# EAGLE board EEZ CF-DIC r5B7 (EAGLE 7.2.0), part 1 of 2
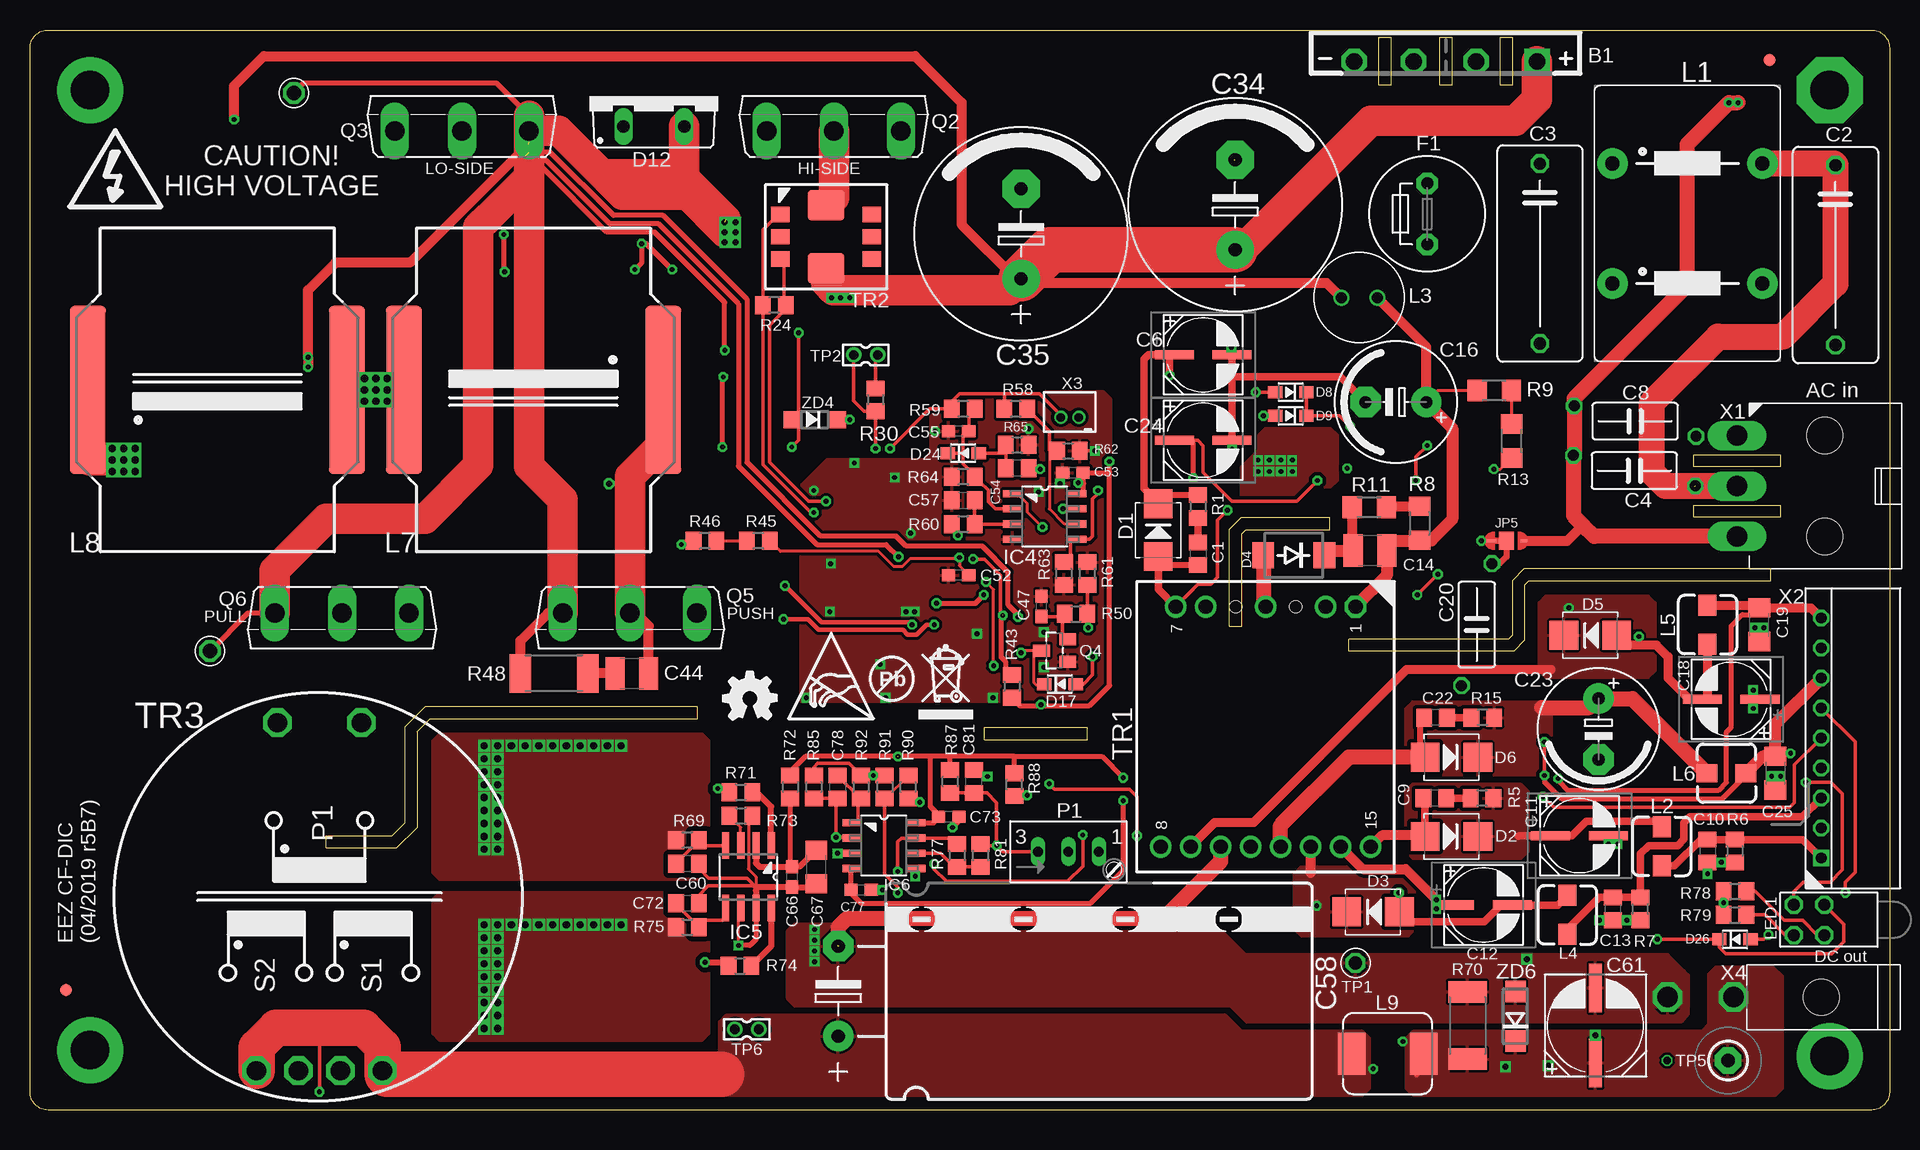
[diagram p3: board, top side]
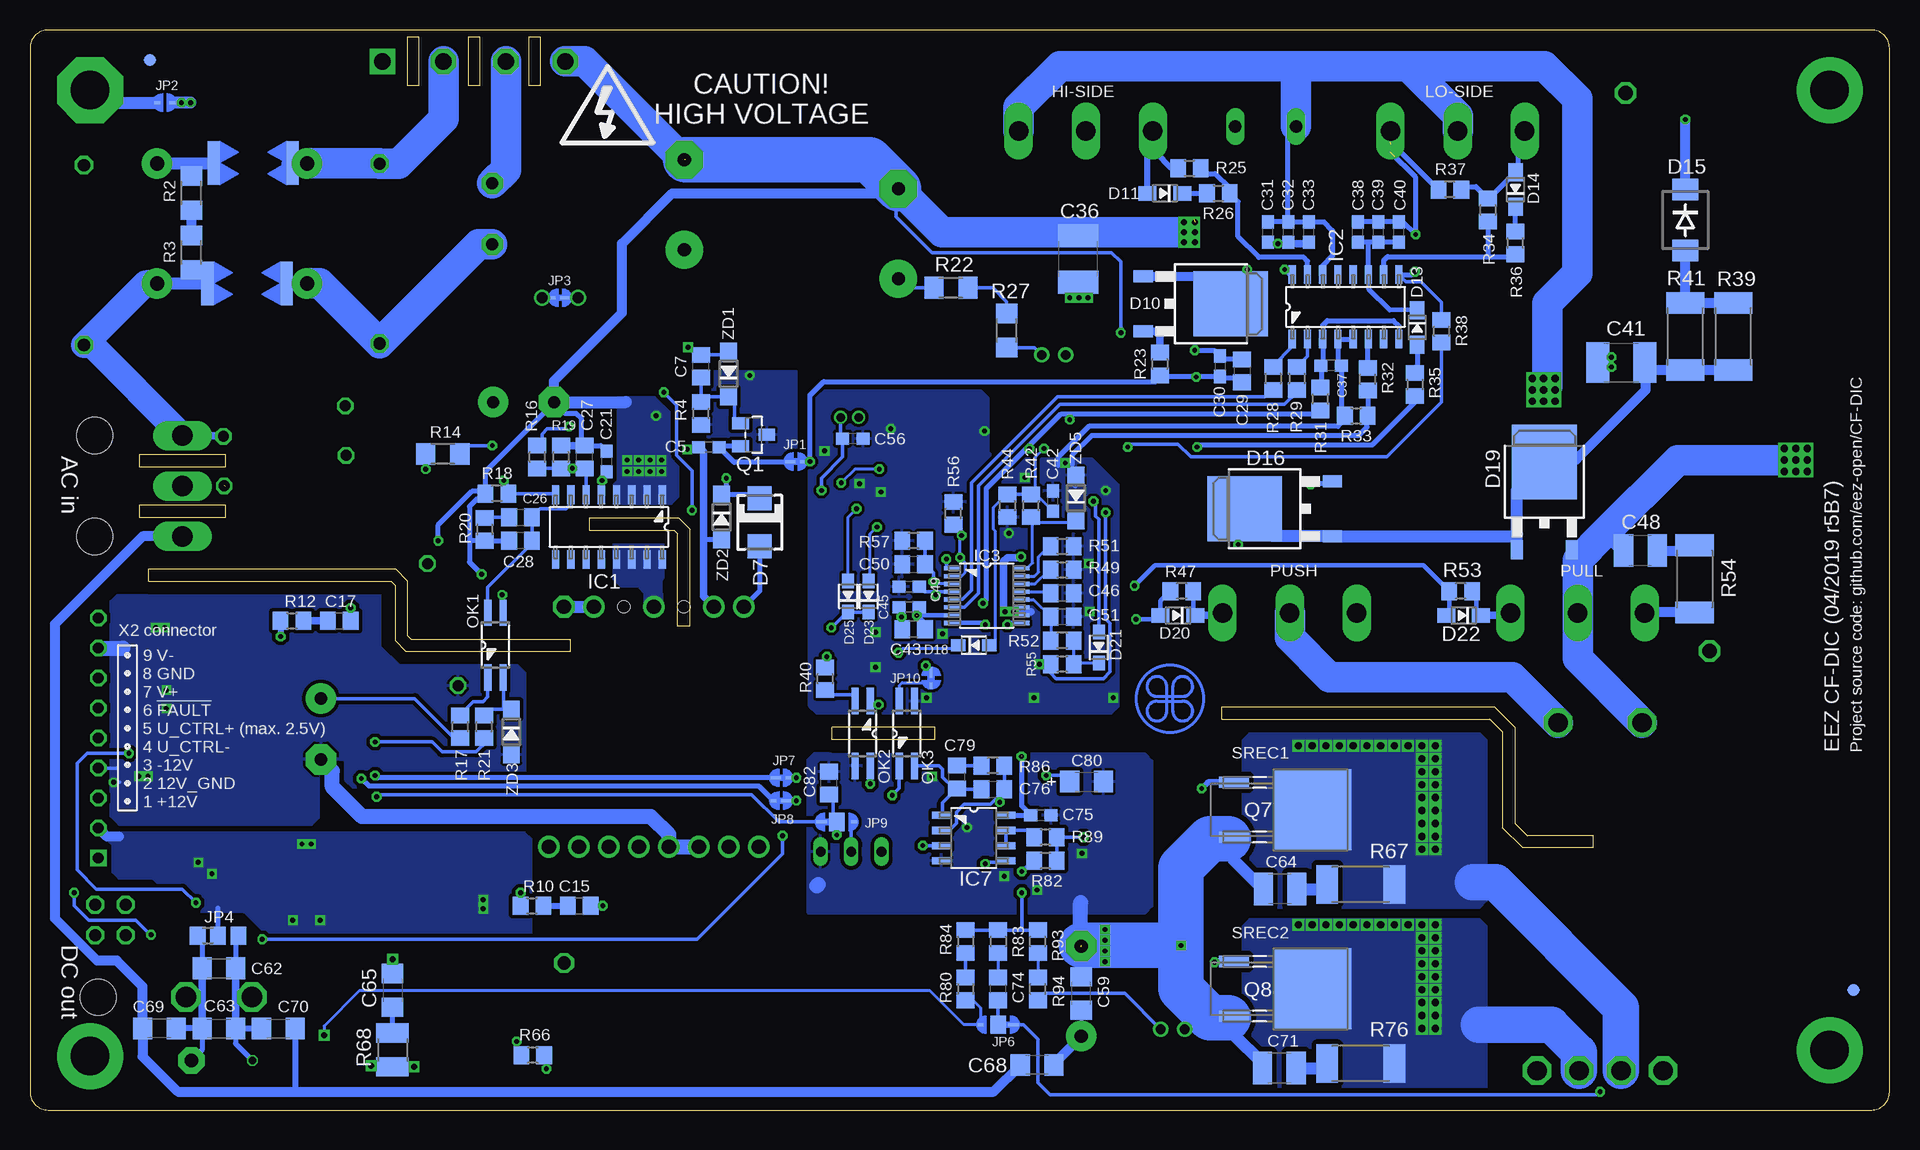
[diagram p4: board, bottom side, seen from below]

Size 155 x 90 mm. Coordinates in mm from the lower left corner, seen from the top.
Outline: 108.35,49.34 100.95,49.34 100,48.39 100,40.29 101.02,40.29 101.02,48.01 101.33,48.32 108.35,48.32 108.35,49.34
Outline: 145.1,45.09 124.52,45.09 123.56,44.12 123.56,39.57 123.24,39.24 109.92,39.24 109.92,38.23 123.69,38.23 124.57,39.13 124.57,43.74 124.9,44.07 145.1,44.07 145.1,45.09
Outline: 79.57,31.88 88.14,31.88 88.14,30.86 79.57,30.86 79.57,31.88
Outline: 155,88.5 155,1.5 arc-90 153.5,0 1.5,0 arc-90 0,1.5 0,88.5 arc-90 1.5,90 153.5,90 arc-90 155,88.5
Outline: 55.63,32.58 55.63,33.59 32.92,33.59 31.24,31.91 31.24,23.9 30.2,22.86 24.7,22.86 24.7,21.84 30.58,21.84 32.26,23.52 32.26,31.53 33.3,32.58 55.63,32.58
Copper layers (1*16): Top 0.035mm / dielectric 1.5mm / Bottom 0.035mm
Design rules "default *": minimum track width 6mil, minimum drill 0.3mm, track to track 6mil, track to pad 6mil, pad to pad 6mil, via to via 6mil, smd to smd 6mil, copper to edge 40mil, drill to drill 8mil, minimum pad ring 4mil, minimum via ring 8mil, stop-mask expansion 2.5mil, vias tented up to drill 2.1mm, thermal gap 8mil
Net classes: 0 default: width 0.203 mm, drill 0.4 mm, clearance 0.203 mm; 2 gnd: width 0.254 mm, drill 0.4 mm, clearance 0.152 mm to class 0, clearance 0.152 mm to class 1, clearance 0.152 mm

## Footprints (pad centres in the part's own frame; a part is rotated, then mirrored left to right if it is on the bottom)
GBU4K_CRE = drill 1.4 square: + -7.62,0 | drill 1.4 octagon: - 7.62,0; AC1 -2.54,0; AC2 2.667,0
C0805 = smd 1.3 x 1.5: 1 -0.95,0; 2 0.95,0
C150-072X183 = drill 1.016 octagon: 1 -7.493,0; 2 7.493,0
CY075-032X103 = drill 0.914 octagon: 1 -5.08,1.27; 2 5.08,-1.27
C0603 = smd 1.1 x 1: 1 -0.85,0; 2 0.85,0
CAPAE660X610N = smd 3.251 x 0.762: 1 -2.413,0; 2 2.413,0
C1210 = smd 1.6 x 2.7: 1 -1.4,0; 2 1.4,0
ECAP5/10.5 = drill 1.016 pad 2.54: + -2.54,0 | drill 1.016 pad 2.54 octagon: - 2.54,0
C1206 = smd 1.6 x 1.8: 1 -1.4,0; 2 1.4,0
ECAP7.5/18 = drill 1.1 pad 3.14: + -3.75,0 | drill 1.1 pad 3.14 octagon: - 3.75,0
C1812 = smd 1.9 x 3.4: 1 -1.95,0; 2 1.95,0
ECAP7.5/18-H35.5A = drill 1.1 pad 2.54: + -3.75,0 | drill 1.1 pad 2.54 octagon: - 3.75,0
CAPAE830X1050N = smd 4.064 x 1.092: + -3.124,0; - 3.124,0
EC1206 = smd 1.6 x 1.8: + -1.4,0; - 1.4,0
SMB = smd 2.4 x 2.4: A 2.2,0; C -2.2,0
DO214AA = smd 1.8 x 2.2: A 2.55,0; C -2.55,0
SMA = smd 2 x 2: A 2,0; C -2,0
SOD323-R = smd 1.2 x 1: A 1.3,0; C -1.3,0
TO252-L = smd 1 x 1.6: 1 -2.28,-6.07; 2 2.28,-6.07 | smd 5.4 x 6.2: 3 0,1.23
SOD323-W = smd 1.5 x 1.2: A 1.45,0; C -1.45,0
TO220-2 = drill 1.016 long: 1 -2.54,-2.54; 2 2.54,-2.54
FUSE_TR5 = drill 1 pad 1.778 octagon: 1 -2.54,0; 2 2.54,0
FIDUCIAL_DUAL = smd 1.016 x 1.016 bottom: B 0,0 | smd 1.016 x 1.016: T 0,0
SOIC-16 = smd 1.549 x 0.61: 1 -2.692,4.445; 2 -2.692,3.175; 3 -2.692,1.905; 4 -2.692,0.635; 5 -2.692,-0.635; 6 -2.692,-1.905; 7 -2.692,-3.175; 8 -2.692,-4.445; 9 2.692,-4.445; 10 2.692,-3.175; 11 2.692,-1.905; 12 2.692,-0.635; 13 2.692,0.635; 14 2.692,1.905; 15 2.692,3.175; 16 2.692,4.445
MTC16 = smd 1.422 x 0.356: 1 -2.845,2.275; 2 -2.845,1.625; 3 -2.845,0.975; 4 -2.845,0.325; 5 -2.845,-0.325; 6 -2.845,-0.975; 7 -2.845,-1.625; 8 -2.845,-2.275; 9 2.845,-2.275; 10 2.845,-1.625; 11 2.845,-0.975; 12 2.845,-0.325; 13 2.845,0.325; 14 2.845,0.975; 15 2.845,1.625; 16 2.845,2.275
SOIC127P600X173-8N = smd 1.55 x 0.6: 1 -2.7,1.9; 2 -2.7,0.63; 3 -2.7,-0.64; 4 -2.7,-1.91; 5 2.7,-1.91; 6 2.7,-0.64; 7 2.7,0.63; 8 2.7,1.9
SO8 = smd 0.6 x 2.2: 1 -1.905,-2.6; 2 -0.635,-2.6; 3 0.635,-2.6; 4 1.905,-2.6; 5 1.905,2.6; 6 0.635,2.6; 7 -0.635,2.6; 8 -1.905,2.6
JP2-NOCUT = smd 0.889 x 0.254: 1 -0.445,0 | smd 0.508 x 0.254: 2 0.635,0
JP2-CUT = smd 0.508 x 0.254: 1 -0.635,0; 2 0.635,0
A0R-JMP = smd 1.5 x 1.3: 1 0,1.7; 2 0,0; 3 0,-1.7
JP3-CUT = smd 1.27 x 1.524: COM 0,0 | smd 0.889 x 0.254: NC -1.27,0 | smd 0.508 x 0.254: NO 1.46,0
RN214 = drill 1.2 pad 2.54: 1 -6.25,-5; 2 6.25,-5; 3 -6.25,5; 4 6.25,5
DE0403 = smd 1.5 x 1.75: 1 0,1.626; 2 0,-1.625
FERSYTER_DSZ6 = drill 0.9: P$1 -1.5,0; P$2 1.5,0
MURATA_6000B = smd 3 x 14: 1 -10.8,0; 2 10.8,0
COILCRAFT_HPI0630 = smd 2.3 x 3.5: 1 -3,0; 2 3,0
WP934MD = drill 1 octagon: BA -1.27,1.27; BC -1.27,-1.27; TA 1.27,1.27; TC 1.27,-1.27
SO4 = smd 0.6 x 2.2: 1 -0.635,-2.7; 2 0.635,-2.7; 3 0.635,2.7; 4 -0.635,2.7
S64W = drill 0.813 long: A 2.54,1.27; E -2.54,1.27; S 0,1.27
SOT23-BEC = smd 1 x 1.4: B -0.95,-1.1; C 0,1.1; E 0.95,-1.1
TO247BV = drill 1.6 long: D 0,-2.921; G -5.588,-2.921; S 5.588,-2.921
SOT23 = smd 1 x 1.4: 1 -0.95,-1.1; 2 0.95,-1.1; 3 0,1.1
TO229P990X239-3N = smd 0.94 x 2.489: 1 -2.286,-6.401; 3 2.286,-6.401 | smd 6.731 x 6.528: 2 0,0.152
R0805 = smd 1.3 x 1.5: 1 -0.95,0; 2 0.95,0
R1206 = smd 1.6 x 1.803: 1 -1.422,0; 2 1.422,0
R2512 = smd 1.8 x 3.2: 1 -2.8,0; 2 2.8,0
R1210 = smd 1.6 x 2.7: 1 -1.4,0; 2 1.4,0
PCB-SAR_2.4MM = smd 3.632 x 1.016: 1 0,-3.302; 2 0,3.302
SHORT_NOHOLE = smd 0.5 x 0.25 bottom: P$1 0,0.117; P$2 0,-0.117
PCB_SHIELD_TAB = drill 1.1 octagon: 1 0,0
2MM-2 = drill 0.8 pad 1.27: 1 0,-1; 2 0,1
TEST-PIN_1.2MM = drill 1.2 octagon: 1 0,0
TP_1.1MM_2 = drill 0.6 octagon: GND 5.08,0 | drill 1.1 pad 2.184 octagon: TIP 0,0
FERYSTER_5572 = drill 1.2 octagon: 1 -10,7.5 | drill 1.2: 2 -10,5; 4 -10,0; 6 -10,-5; 7 -10,-7.5; 8 10,-8.75; 9 10,-6.25; 10 10,-3.75; 11 10,-1.25; 12 10,1.25; 13 10,3.75; 14 10,6.25; 15 10,8.75 | hole 1: -10,2.5; -10,-2.5
MURATA_5300 = smd 1.27 x 1.524: 1 -1.854,-3.81; 2 0,-3.81; 3 1.854,-3.81; 4 1.854,3.81; 5 0,3.81; 6 -1.854,3.81 | smd 2.54 x 3.048: 7 2.616,0; 8 -2.616,0
VAC_DUAL_SEC = drill 1.6 octagon: P1 -14.5,3.5; P1_DOT -14.5,-3.5; S1 14.5,5.25; S1_DOT 14.5,1.75; S2 14.5,-1.75; S2_DOT 14.5,-5.25
MINIFIT_6659-3_CRE = drill 1.7 long: 1 0,-4.2; 2 0,0; 3 0,4.2 | hole 3: -7.3,4.2; -7.3,-4.2
SPOX_22-05-7095 = drill 0.9 square: 1 -10,0 | drill 0.9 octagon: 2 -7.5,0; 3 -5,0; 4 -2.5,0; 5 0,0; 6 2.5,0; 7 5,0; 8 7.5,0; 9 10,0
B2B-ZR = drill 0.7 pad 1.1: 1 -0.75,0; 2 0.75,0
MINIFIT_39301020 = drill 1.7 octagon: 1 0,0; 2 0,5.5 | hole 3: 0,-7.3
SOD123 = smd 1.4 x 1.4: A 1.9,0; C -1.9,0
DO214AC = smd 1.8 x 1.7: A 2.05,0; C -2.05,0

## Placement (x,y rotation side)
B1  GBU4K  [GBU4K_CRE]  118,87.38 180 top
C1  3n3  [C0805]  97.35,46.35 270 top
C2  MKP-X2-220NR15/310  [C150-072X183]  150.5,71.25 270 top
C3  MKP-X2-220NR15/310  [C150-072X183]  125.86,71.37 270 top
C4  CY1Y-4N7  [CY075-032X103]  133.73,53.28 0 top
C5  N.C.  [C0603]  98.42,55.24 180 bottom
C6  EEEFK1V470P  [CAPAE660X610N]  97.79,62.93 0 top
C7  1u  [C0805]  99.06,61.98 90 bottom
C8  CY1Y-4N7  [CY075-032X103]  133.79,57.4 0 top
C9  3n3  [C0805]  117.09,25.97 180 top
C10  1u  [C0805]  139.83,21.59 270 top
C11  EEEFK1V470P  [CAPAE660X610N]  129.16,22.86 0 top
C12  EEEFK1V470P  [CAPAE660X610N]  121.16,17.08 0 top
C13  1u  [C0805]  131.95,16.76 90 top
C14  1n/1kV  [C1210]  111.7,46.61 180 top
C15  3n3  [C0805]  109.22,17.02 0 bottom
C16  UCY2G6R8MPD  [ECAP5/10.5]  113.86,58.99 180 top
C17  3n3  [C0805]  129.22,40.77 0 bottom
C18  EEEFK1V470P  [CAPAE660X610N]  141.8,34.23 180 top
C19  4u7  [C1206]  144.15,40.45 90 top
C20  CY1Y-4N7  [CY075-032X103]  120.59,40.45 270 top
C21  100n  [C0603]  106.93,54.04 270 bottom
C22  3n3  [C0805]  117.16,32.7 180 top
C23  470u  [ECAP5/10.5]  130.75,31.75 270 top
C24  EEEFK1V470P  [CAPAE660X610N]  97.79,55.82 0 top
C25  4u7  [C1206]  145.48,28.07 270 top
C26  33n  [C0805]  114.11,49.4 0 bottom
C27  47p/200V  [C0805]  108.78,54.42 90 bottom
C28  2n2  [C0805]  114.11,47.43 180 bottom
C29  1u  [C0805]  53.98,61.59 270 bottom
C30  100n  [C0603]  55.82,61.98 270 bottom
C31  10n  [C0603]  51.82,73.15 90 bottom
C32  100n  [C0603]  50.1,73.15 90 bottom
C33  100n  [C0603]  48.39,73.15 90 bottom
C34  UPH2G151MHD6  [ECAP7.5/18]  100.46,75.44 90 top
C35  UPH2G151MHD6  [ECAP7.5/18]  82.61,73.03 90 top
C36  100n/500V  [C1812]  67.63,70.93 90 bottom
C37  100n  [C0603]  46.55,62.04 180 bottom
C38  10n  [C0603]  44.32,73.15 90 bottom
C39  100n  [C0603]  42.61,73.15 90 bottom
C40  100n  [C0603]  40.89,73.15 90 bottom
C41  100n/500V  [C1812]  22.35,62.29 0 bottom
C42  100n  [C0603]  69.72,50.74 90 bottom
C43  1u  [C0805]  81.34,40.07 180 bottom
C44  2n2/1kV  [C1210]  50.16,36.39 0 top
C45  100n  [C0603]  81.72,41.91 180 bottom
C46  1u  [C0805]  68.96,43.05 180 bottom
C47  10n  [C0603]  84.33,41.97 90 top
C48  2n2/1kV  [C1210]  20.76,46.61 180 bottom
C49  100n  [C0603]  81.72,43.62 0 bottom
C50  470p  [C0805]  81.34,45.47 0 bottom
C51  470p  [C0805]  68.96,41.08 180 bottom
C52  10n  [C0603]  77.41,44.58 180 top
C53  100n  [C0603]  86.93,53.09 180 top
C54  1u  [C0805]  82.3,53.47 180 top
C55  100n  [C0603]  77.41,56.58 180 top
C56  N.C.  [C0603]  86.42,55.94 180 bottom
C57  1u  [C0805]  77.79,50.8 0 top
C58  UVZ1J222MHD  [ECAP7.5/18-H35.5A]  67.37,9.91 90 top
C59  1u/100V  [C1206]  67.37,9.72 90 bottom
C60  47p/200V  [C0805]  54.8,20.51 180 top
C61  HHXC630ARA330MHA0G  [CAPAE830X1050N]  130.49,7.05 90 top
C62  1u/100V  [C1206]  139.26,11.81 0 bottom
C63  100n/100V  [C1206]  139.26,6.79 0 bottom
C64  2n2/1kV  [C1210]  50.8,18.41 180 bottom
C65  N.C.  [C1206]  124.78,9.97 270 bottom
C66  100n  [C0603]  63.5,19.43 270 top
C67  4u7  [C1206]  65.53,20.26 270 top
C68  N.C.  [C1206]  71.06,3.75 180 bottom
C69  100n/100V  [C1206]  144.21,6.79 180 bottom
C70  100n/100V  [C1206]  134.3,6.79 0 bottom
C71  2n2/1kV  [C1210]  50.86,3.49 180 bottom
C72  47p/200V  [C0805]  54.8,17.21 180 top
C73  100n  [C0603]  76.58,24.45 0 top
C74  4n7  [C0805]  74.3,10.1 90 bottom
C75  100n  [C0603]  70.74,24.57 0 bottom
C76  47p/200V  [C0805]  74.74,26.73 0 bottom
C77  100n  [C0603]  69.28,18.35 0 top
C78  100p  [C0805]  67.31,26.92 270 top
C79  1n  [C0805]  77.72,27.75 90 bottom
C80  N.C.  [EC1206]  66.93,27.37 0 bottom
C81  1u  [C0805]  78.68,27.37 90 top
C82  N.C.  [C0805]  88.39,27.24 90 bottom
D1  SS110B  [SMB]  94.04,48.32 270 top
D2  SS110B  [SMB]  118.49,22.8 180 top
D3  SS110B  [SMB]  111.95,16.51 0 top
D4  US1K-DIO  [DO214AA]  105.35,46.23 180 top
D5  SS110B  [SMB]  130.05,39.56 0 top
D6  SS110B  [SMB]  118.49,29.4 180 top
D7  SS110B  [SMA]  94.17,48.96 270 bottom
D8  BAS316  [SOD323-R]  105.09,59.82 180 top
D9  BAS316  [SOD323-R]  105.09,57.85 180 top
D10  C3D02065E  [TO252-L]  56.13,67.18 270 bottom
D11  N.C.  [SOD323-W]  60.39,76.39 180 bottom
D12  C3D03060A  [TO220-2]  52,84.5 0 top
D13  1N5819HW-7-F  [SOD323-W]  39.37,65.21 270 bottom
D14  N.C.  [SOD323-W]  31.18,76.71 90 bottom
D15  US1K-DIO  [DO214AA]  17.02,74.17 270 bottom
D16  C3D02065E  [TO252-L]  52.51,50.1 90 bottom
D17  BAS316  [SOD323-R]  85.85,35.5 0 top
D18  BAS316  [SOD323-R]  76.33,38.73 0 bottom
D19  C3D02065E  [TO252-L]  28.77,52.77 0 bottom
D20  N.C.  [SOD323-W]  59.31,41.21 180 bottom
D21  BAS316  [SOD323-R]  65.91,38.54 90 bottom
D22  N.C.  [SOD323-W]  35.5,41.21 180 bottom
D23  BAS316  [SOD323-R]  85.09,42.8 90 bottom
D24  BAS316  [SOD323-R]  77.79,54.74 0 top
D25  BAS316  [SOD323-R]  86.8,42.8 90 bottom
D26  BAS316  [SOD323-R]  142.11,14.22 0 top
EEZ_SIGNATURE  SIGNATURESMALL  [SIGNATURE_5MM]  59.99,34.27 180 top
F1  0031.7601  [FUSE_TR5]  116.46,74.68 90 top
FM1  FIDUCIAL_2  [FIDUCIAL_DUAL]  145,87.5 270 top
FM2  FIDUCIAL_2  [FIDUCIAL_DUAL]  3,10 270 top
IC1  VIPer35L  [SOIC-16]  106.74,48.58 270 bottom
IC2  SI8233BB-D-IS1  [SOIC-16]  45.34,66.93 90 bottom
IC3  LM5041B  [MTC16]  75.25,42.86 0 bottom
IC4  LM258D  [SOIC127P600X173-8N]  84.58,49.47 0 top
IC5  IR11688STRPBF  [SO8]  59.88,19.43 180 top
IC6  LM258D  [SOIC127P600X173-8N]  71.18,22.03 0 top
IC7  TL103W  [SOIC127P600X173-8N]  76.33,22.67 0 bottom
JP1  JP2-NOCUT  [JP2-NOCUT]  91.19,54.04 0 bottom
JP2  JP2-CUT  [JP2-CUT]  143.76,83.95 180 bottom
JP3  JP2-NOCUT  [JP2-NOCUT]  110.81,67.69 180 bottom
JP4  0R-JUMPA  [A0R-JMP]  139.32,14.54 90 bottom
JP5  JP3-CUT  [JP3-CUT]  123.06,47.43 0 top
JP6  JP3-CUT  [JP3-CUT]  74.3,7.11 180 bottom
JP7  JP2-NOCUT  [JP2-NOCUT]  92.39,27.69 0 bottom
JP8  JP2-NOCUT  [JP2-NOCUT]  92.39,25.78 180 bottom
JP9  JP3-CUT  [JP3-CUT]  87.76,24 0 bottom
JP10  JP2-NOCUT  [JP2-NOCUT]  79.88,36 270 bottom
L1  RN214-2.5-02-3M3  [RN214]  138.15,73.88 0 top
L2  DLG-0403-180  [DE0403]  136.02,21.97 0 top
L3  RLB0812-471KL  [FERSYTER_DSZ6]  110.81,67.69 0 top
L4  DLG-0403-180  [DE0403]  128.14,16.26 0 top
L5  DLG-0403-180  [DE0403]  139.83,40.45 180 top
L6  DLG-0403-180  [DE0403]  141.41,28.07 90 top
L7  60B684C  [MURATA_6000B]  41.97,60.01 180 top
L8  60B684C  [MURATA_6000B]  15.62,60.01 0 top
L9  3u3/5A  [COILCRAFT_HPI0630]  113.16,4.7 0 top
LED1  WP934MD/LYLID  [WP934MD]  148.3,15.85 180 top
OK1  TLP291-GB.SE-T  [SO4]  116.2,38.73 0 bottom
OK2  TLP291-GB.SE-T  [SO4]  85.6,31.37 180 bottom
OK3  TLP291-GB.SE-T  [SO4]  81.92,31.37 0 bottom
P1  T910W-50K  [S64W]  86.55,20.26 0 top
Q1  MMBT5551  [SOT23-BEC]  94.68,56.26 270 bottom
Q2  C3M0280090D  [TO247BV]  67,84.5 0 top
Q3  C3M0280090D  [TO247BV]  36,84.5 0 top
Q4  NYC0102BLT1G  [SOT23]  85.41,38.29 90 top
Q5  IRFP4332PBF  [TO247BV]  50,38.5 180 top
Q6  IRFP4332PBF  [TO247BV]  26,38.5 180 top
Q7  FDD86250-F085  [TO229P990X239-3N]  48.26,25.02 270 bottom
Q8  FDD86250-F085  [TO229P990X239-3N]  48.26,10.1 270 bottom
R1  120R  [R0805]  97.35,50.29 270 top
R2  470K  [R1206]  141.54,76.4 270 bottom
R3  470K  [R1206]  141.54,71.45 270 bottom
R4  1K8  [R0805]  99.06,58.04 90 bottom
R5  120R  [R0805]  121.03,25.97 180 top
R6  4K7  [R0805]  142.11,21.59 270 top
R7  4K7  [R0805]  134.24,16.76 90 top
R8  100K  [R1206]  115.82,48.9 90 top
R9  100K  [R1206]  122.05,59.94 0 top
R10  120R  [R0805]  113.16,17.02 0 bottom
R11  100K  [R1206]  111.63,50.23 0 top
R12  120R  [R0805]  133.16,40.77 0 bottom
R13  100K  [R1206]  123.51,55.75 270 top
R14  100K  [R1206]  120.59,54.67 0 bottom
R15  120R  [R0805]  121.09,32.7 180 top
R16  30K  [R0805]  112.71,54.42 90 bottom
R17  1K  [R0805]  119.13,31.94 90 bottom
R18  1K8  [R0805]  116.08,51.37 180 bottom
R19  4K7  [R0805]  110.74,54.42 270 bottom
R20  47K  [R0805]  117.09,48.39 270 bottom
R21  1K  [R0805]  117.16,31.94 270 bottom
R22  100K  [R1206]  78.23,68.52 0 bottom
R23  10R  [R0805]  60.83,62.17 270 bottom
R24  10K  [R0805]  62.04,67.08 180 top
R25  10R  [R0805]  58.36,78.49 0 bottom
R26  N.C.  [R0805]  55.94,76.39 0 bottom
R27  100K  [R1206]  73.6,64.96 270 bottom
R28  100R  [R0805]  51.37,60.96 270 bottom
R29  100R  [R0805]  49.4,60.96 270 bottom
R30  86K6  [R0805]  70.48,59.18 270 top
R31  10R  [R0805]  47.43,59.25 90 bottom
R32  30K  [R0805]  43.5,60.9 90 bottom
R33  1R  [R0805]  44.45,57.85 0 bottom
R34  10R  [R0805]  33.46,74.99 90 bottom
R35  10R  [R0805]  39.56,60.45 270 bottom
R36  N.C.  [R0805]  31.18,72.26 90 bottom
R37  47K  [R0805]  36.64,76.71 180 bottom
R38  1R  [R0805]  37.34,64.9 90 bottom
R39  22R/2-3W  [R2512]  13.02,64.45 90 bottom
R40  1K  [R0805]  88.71,35.94 90 bottom
R41  N.C.  [R2512]  17.02,64.45 90 bottom
R42  1K  [R0805]  71.56,50.36 90 bottom
R43  10R  [R0805]  81.85,35.31 270 top
R44  8K2  [R0805]  73.53,50.36 270 bottom
R45  86K6  [R0805]  60.71,47.43 180 top
R46  86K6  [R0805]  56.26,47.43 180 top
R47  10R  [R0805]  58.99,43.24 180 bottom
R48  47R/2-3W  [R2512]  43.69,36.39 180 top
R49  15K  [R0805]  68.96,45.02 0 bottom
R50  4K7  [R0805]  87.19,41.34 0 top
R51  68K  [R0805]  68.96,46.99 0 bottom
R52  220R  [R0805]  68.96,39.12 180 bottom
R53  10R  [R0805]  35.75,43.24 180 bottom
R54  47R/2-3W  [R2512]  16.26,44.26 270 bottom
R55  6R2  [R0805]  68.96,37.15 180 bottom
R56  1K  [R0805]  78.04,49.72 90 bottom
R57  7K5  [R0805]  81.34,47.43 180 bottom
R58  4K7  [R0805]  82.17,58.42 180 top
R59  5K6  [R0805]  77.79,58.42 180 top
R60  86K6  [R0805]  77.79,48.83 0 top
R61  1K  [R0805]  88.14,44.7 90 top
R62  30K  [R0805]  86.55,54.93 0 top
R63  10K  [R0805]  86.17,44.7 270 top
R64  1K  [R0805]  77.79,52.77 180 top
R65  1K  [R0805]  82.3,55.44 0 top
R66  120R  [R0805]  113.09,4.57 180 bottom
R67  22R/2-3W  [R2512]  44.07,18.8 180 bottom
R68  N.C.  [R1210]  124.78,5.02 270 bottom
R69  1K  [R0805]  54.8,22.48 180 top
R70  N.C.  [R2512]  119.82,7.05 270 top
R71  10R  [R0805]  59.25,26.48 0 top
R72  10R  [R0805]  63.37,26.92 270 top
R73  86K6  [R0805]  59.25,24.51 0 top
R74  10R  [R0805]  59.18,12 0 top
R75  1K  [R0805]  54.8,15.24 0 top
R76  22R/2-3W  [R2512]  44.07,3.87 180 bottom
R77  10K  [R0805]  77.28,21.21 270 top
R78  470R  [R0805]  142.11,18.22 0 top
R79  470R  [R0805]  142.11,16.26 0 top
R80  150K  [R0805]  77.03,10.1 270 bottom
R81  10K  [R0805]  79.25,21.21 90 top
R82  1K  [R0805]  70.36,20.76 180 bottom
R83  1K  [R0805]  74.3,14.03 270 bottom
R84  1K8  [R0805]  77.03,14.03 270 bottom
R85  1K  [R0805]  65.34,26.92 270 top
R86  86K6  [R0805]  74.74,28.7 180 bottom
R87  1K8  [R0805]  76.71,27.37 90 top
R88  3K3  [R0805]  82.04,27.11 90 top
R89  1K  [R0805]  70.36,22.73 180 bottom
R90  5K6  [R0805]  73.22,26.92 90 top
R91  7K5  [R0805]  71.25,26.92 270 top
R92  220R  [R0805]  69.28,26.92 270 top
R93  N.C.  [R0805]  70.99,14.03 90 bottom
R94  N.C.  [R0805]  70.99,10.1 90 bottom
SAR1  PCB 2.4mm  [PCB-SAR_2.4MM]  136.4,78.92 270 bottom
SAR2  PCB 2.4mm  [PCB-SAR_2.4MM]  136.9,68.88 270 bottom
SH1  [SHORT_NOHOLE]  100.46,79.18 270 top
SH2  [SHORT_NOHOLE]  69.91,36.7 180 top
SH3  [SHORT_NOHOLE]  72.52,46.04 90 top
SH4  [SHORT_NOHOLE]  29.91,2.98 270 bottom
TP1  [PCB_SHIELD_TAB]  110.49,12.26 0 top
TP2  [2MM-2]  69.66,62.93 90 top
TP3  [TEST-PIN_1.2MM]  22,84.75 270 top
TP4  [TEST-PIN_1.2MM]  15,38.25 270 top
TP5  [TP_1.1MM_2]  141.54,4.13 180 top
TP6  [2MM-2]  59.75,6.73 90 top
TR1  FERYSTER_5851  [FERYSTER_5572]  103,31.94 270 top
TR2  53100C  [MURATA_5300]  66.36,72.77 270 top
TR3  VAC T60006-L2025-W380  [VAC_DUAL_SEC]  24.13,17.78 270 top
U$2  [RECYCLE_BIN1/8]  74.05,32.58 0 top
U$4  [ESD_SYMBOL]  63.22,32.62 0 top
U$7  [PB_SMALL]  71.82,35.94 0 top
X1  39-30-3035  [MINIFIT_6659-3_CRE]  142.3,52 180 top
X2  22-05-7095  [SPOX_22-05-7095]  149.3,31 90 top
X3  B2B-ZR  [B2B-ZR]  86.68,57.72 180 top
X4  39-30-1020  [MINIFIT_39301020]  142,9.4 90 top
ZD1  BZT52C13  [SOD123]  96.77,61.34 90 bottom
ZD2  BZT52C20-DC  [SOD123]  97.35,49.4 270 bottom
ZD3  MMSZ5V1T1G  [SOD123]  114.87,31.5 270 bottom
ZD4  MMSZ5V1T1G  [SOD123]  65.41,57.53 180 top
ZD5  BZT52C6V2  [SOD123]  67.82,50.99 90 bottom
ZD6  SMAJ58A-TR  [DO214AC]  123.83,7.81 90 top